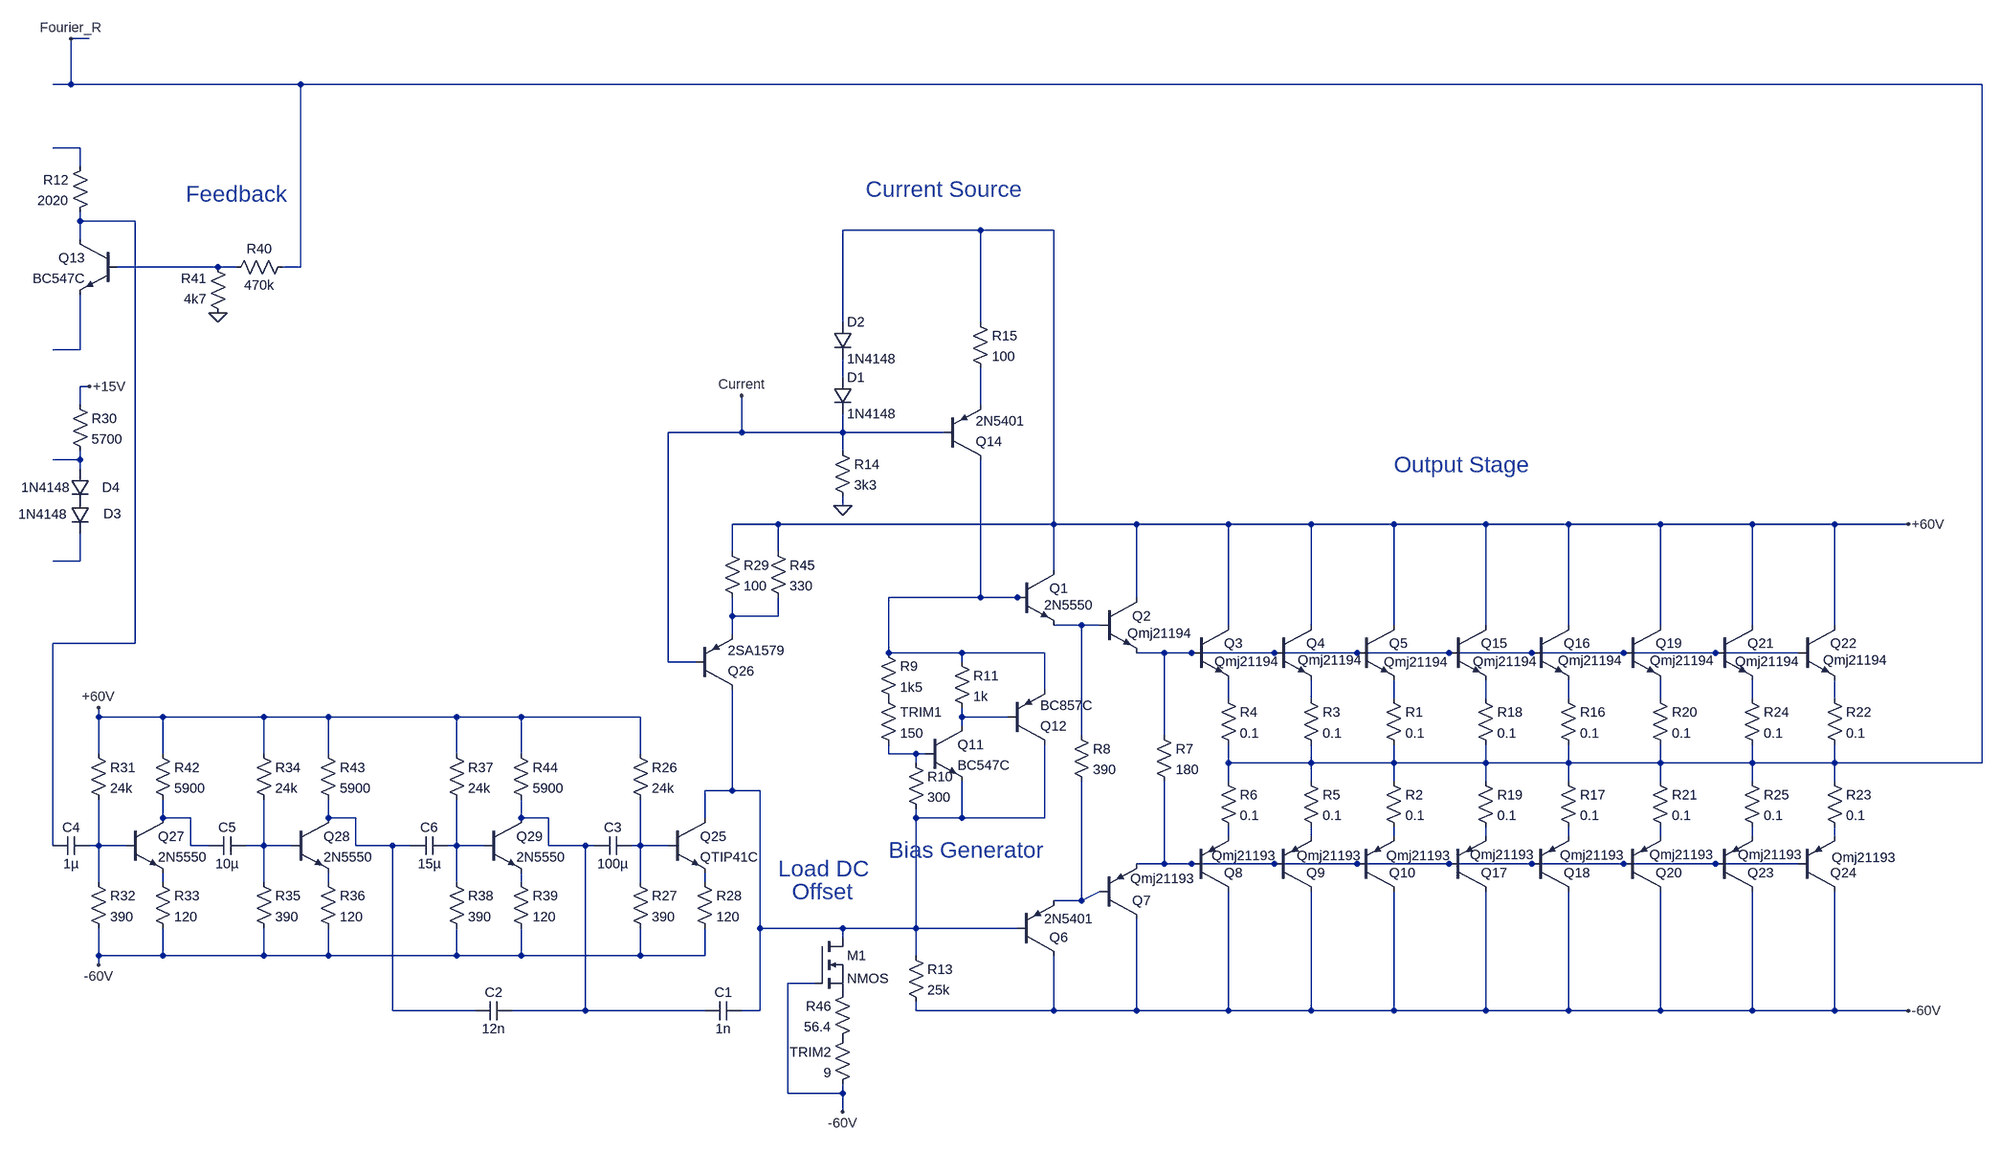
[diagram p0: schematic paltkz2.asc]
paltkz2.asc, the LTspice schematic file:
Version 4
SHEET 1 16980 7664
WIRE 9680 4096 9648 4096
WIRE 9648 4176 9648 4096
WIRE 9648 4176 9616 4176
WIRE 10048 4176 9648 4176
WIRE 12976 4176 10048 4176
WIRE 9664 4368 9616 4368
WIRE 9664 4400 9664 4368
WIRE 9664 4496 9664 4480
WIRE 9760 4496 9664 4496
WIRE 11232 4512 10992 4512
WIRE 11360 4512 11232 4512
WIRE 9664 4528 9664 4496
WIRE 9904 4576 9728 4576
WIRE 9936 4576 9904 4576
WIRE 10048 4576 10048 4176
WIRE 10048 4576 10016 4576
WIRE 10992 4672 10992 4512
WIRE 11232 4672 11232 4512
WIRE 9664 4720 9664 4624
WIRE 9664 4720 9616 4720
WIRE 10992 4768 10992 4736
WIRE 9680 4784 9664 4784
WIRE 9664 4816 9664 4784
WIRE 11232 4816 11232 4752
WIRE 10816 4864 10816 4800
WIRE 10816 4864 10688 4864
WIRE 10992 4864 10992 4832
WIRE 10992 4864 10816 4864
WIRE 11168 4864 10992 4864
WIRE 10992 4896 10992 4864
WIRE 9664 4912 9664 4896
WIRE 9664 4912 9616 4912
WIRE 9664 4928 9664 4912
WIRE 9664 4992 9664 4976
WIRE 10992 4992 10992 4976
WIRE 10880 5024 10800 5024
WIRE 11360 5024 11360 4512
WIRE 11360 5024 10880 5024
WIRE 11504 5024 11360 5024
WIRE 11664 5024 11504 5024
WIRE 11808 5024 11664 5024
WIRE 11952 5024 11808 5024
WIRE 12112 5024 11952 5024
WIRE 12256 5024 12112 5024
WIRE 12416 5024 12256 5024
WIRE 12576 5024 12416 5024
WIRE 12720 5024 12576 5024
WIRE 12848 5024 12720 5024
WIRE 10800 5072 10800 5024
WIRE 10880 5072 10880 5024
WIRE 9664 5088 9664 5040
WIRE 9664 5088 9616 5088
WIRE 11360 5104 11360 5024
WIRE 11232 5152 11232 4912
WIRE 11232 5152 11072 5152
WIRE 11296 5152 11232 5152
WIRE 11312 5152 11296 5152
WIRE 11504 5152 11504 5024
WIRE 10800 5184 10800 5152
WIRE 10880 5184 10880 5152
WIRE 10880 5184 10800 5184
WIRE 11408 5200 11360 5200
WIRE 11440 5200 11408 5200
WIRE 11664 5200 11664 5024
WIRE 11808 5200 11808 5024
WIRE 11952 5200 11952 5024
WIRE 12112 5200 12112 5024
WIRE 12256 5200 12256 5024
WIRE 12416 5200 12416 5024
WIRE 12576 5200 12576 5024
WIRE 12720 5200 12720 5024
WIRE 10800 5216 10800 5184
WIRE 9760 5232 9760 4496
WIRE 9760 5232 9616 5232
WIRE 11072 5248 11072 5152
WIRE 11200 5248 11072 5248
WIRE 11344 5248 11200 5248
WIRE 11552 5248 11504 5248
WIRE 11600 5248 11552 5248
WIRE 11744 5248 11600 5248
WIRE 11888 5248 11744 5248
WIRE 12048 5248 11888 5248
WIRE 12192 5248 12048 5248
WIRE 12352 5248 12192 5248
WIRE 12512 5248 12352 5248
WIRE 12656 5248 12512 5248
WIRE 10688 5264 10688 4864
WIRE 10736 5264 10688 5264
WIRE 11200 5264 11200 5248
WIRE 11344 5312 11344 5248
WIRE 11664 5328 11664 5296
WIRE 11808 5328 11808 5296
WIRE 11952 5328 11952 5296
WIRE 12112 5328 12112 5296
WIRE 12256 5328 12256 5296
WIRE 12416 5328 12416 5296
WIRE 12576 5328 12576 5296
WIRE 12720 5328 12720 5296
WIRE 9696 5360 9696 5344
WIRE 9808 5360 9696 5360
WIRE 9984 5360 9808 5360
WIRE 10096 5360 9984 5360
WIRE 10320 5360 10096 5360
WIRE 10432 5360 10320 5360
WIRE 10640 5360 10432 5360
WIRE 11200 5360 11200 5344
WIRE 11280 5360 11200 5360
WIRE 11200 5376 11200 5360
WIRE 11408 5392 11408 5200
WIRE 11552 5392 11552 5248
WIRE 9696 5424 9696 5360
WIRE 9808 5424 9808 5360
WIRE 9984 5424 9984 5360
WIRE 10096 5424 10096 5360
WIRE 10320 5424 10320 5360
WIRE 10432 5424 10432 5360
WIRE 10640 5424 10640 5360
WIRE 11072 5424 11072 5408
WIRE 11120 5424 11072 5424
WIRE 11136 5424 11120 5424
WIRE 11120 5440 11120 5424
WIRE 11664 5440 11664 5408
WIRE 11808 5440 11808 5408
WIRE 11808 5440 11664 5440
WIRE 11952 5440 11952 5408
WIRE 11952 5440 11808 5440
WIRE 12112 5440 12112 5408
WIRE 12112 5440 11952 5440
WIRE 12256 5440 12256 5408
WIRE 12256 5440 12112 5440
WIRE 12416 5440 12416 5408
WIRE 12416 5440 12256 5440
WIRE 12576 5440 12576 5408
WIRE 12576 5440 12416 5440
WIRE 12720 5440 12720 5408
WIRE 12720 5440 12576 5440
WIRE 12976 5440 12976 4176
WIRE 12976 5440 12720 5440
WIRE 11664 5472 11664 5440
WIRE 11808 5472 11808 5440
WIRE 11952 5472 11952 5440
WIRE 12112 5472 12112 5440
WIRE 12256 5472 12256 5440
WIRE 12416 5472 12416 5440
WIRE 12576 5472 12576 5440
WIRE 12720 5472 12720 5440
WIRE 10800 5488 10800 5312
WIRE 10800 5488 10752 5488
WIRE 10848 5488 10800 5488
WIRE 9808 5536 9808 5504
WIRE 9856 5536 9808 5536
WIRE 10096 5536 10096 5504
WIRE 10144 5536 10096 5536
WIRE 10432 5536 10432 5504
WIRE 10480 5536 10432 5536
WIRE 10752 5536 10752 5488
WIRE 11120 5536 11120 5520
WIRE 11200 5536 11200 5472
WIRE 11200 5536 11120 5536
WIRE 11344 5536 11344 5408
WIRE 11344 5536 11200 5536
WIRE 11664 5568 11664 5552
WIRE 11808 5568 11808 5552
WIRE 11952 5568 11952 5552
WIRE 12112 5568 12112 5552
WIRE 12256 5568 12256 5552
WIRE 12416 5568 12416 5552
WIRE 12576 5568 12576 5552
WIRE 12720 5568 12720 5552
WIRE 9616 5584 9616 5232
WIRE 9696 5584 9696 5504
WIRE 9696 5584 9680 5584
WIRE 9744 5584 9696 5584
WIRE 9856 5584 9856 5536
WIRE 9888 5584 9856 5584
WIRE 9984 5584 9984 5504
WIRE 9984 5584 9952 5584
WIRE 10032 5584 9984 5584
WIRE 10144 5584 10144 5536
WIRE 10208 5584 10144 5584
WIRE 10240 5584 10208 5584
WIRE 10320 5584 10320 5504
WIRE 10320 5584 10304 5584
WIRE 10368 5584 10320 5584
WIRE 10480 5584 10480 5536
WIRE 10544 5584 10480 5584
WIRE 10560 5584 10544 5584
WIRE 10640 5584 10640 5504
WIRE 10640 5584 10624 5584
WIRE 10688 5584 10640 5584
WIRE 11552 5616 11552 5472
WIRE 11552 5616 11504 5616
WIRE 11600 5616 11552 5616
WIRE 11744 5616 11600 5616
WIRE 11888 5616 11744 5616
WIRE 12048 5616 11888 5616
WIRE 12192 5616 12048 5616
WIRE 12352 5616 12192 5616
WIRE 12512 5616 12352 5616
WIRE 12656 5616 12512 5616
WIRE 9696 5648 9696 5584
WIRE 9808 5648 9808 5632
WIRE 9984 5648 9984 5584
WIRE 10096 5648 10096 5632
WIRE 10320 5648 10320 5584
WIRE 10432 5648 10432 5632
WIRE 10640 5648 10640 5584
WIRE 10752 5648 10752 5632
WIRE 11408 5680 11408 5472
WIRE 11408 5680 11440 5664
WIRE 11408 5680 11360 5680
WIRE 10848 5728 10848 5488
WIRE 10992 5728 10848 5728
WIRE 11120 5728 11120 5536
WIRE 11120 5728 10992 5728
WIRE 11296 5728 11120 5728
WIRE 10992 5744 10992 5728
WIRE 9696 5776 9696 5728
WIRE 9808 5776 9808 5728
WIRE 9808 5776 9696 5776
WIRE 9984 5776 9984 5728
WIRE 9984 5776 9808 5776
WIRE 10096 5776 10096 5728
WIRE 10096 5776 9984 5776
WIRE 10320 5776 10320 5728
WIRE 10320 5776 10096 5776
WIRE 10432 5776 10432 5728
WIRE 10432 5776 10320 5776
WIRE 10640 5776 10640 5728
WIRE 10640 5776 10432 5776
WIRE 10752 5776 10752 5728
WIRE 10752 5776 10640 5776
WIRE 11120 5776 11120 5728
WIRE 9696 5792 9696 5776
WIRE 10944 5824 10896 5824
WIRE 10208 5872 10208 5584
WIRE 10352 5872 10208 5872
WIRE 10544 5872 10544 5584
WIRE 10544 5872 10416 5872
WIRE 10752 5872 10544 5872
WIRE 10848 5872 10848 5728
WIRE 10848 5872 10816 5872
WIRE 11120 5872 11120 5856
WIRE 11360 5872 11360 5776
WIRE 11360 5872 11120 5872
WIRE 11504 5872 11504 5712
WIRE 11504 5872 11360 5872
WIRE 11664 5872 11664 5664
WIRE 11664 5872 11504 5872
WIRE 11808 5872 11808 5664
WIRE 11808 5872 11664 5872
WIRE 11952 5872 11952 5664
WIRE 11952 5872 11808 5872
WIRE 12112 5872 12112 5664
WIRE 12112 5872 11952 5872
WIRE 12256 5872 12256 5664
WIRE 12256 5872 12112 5872
WIRE 12416 5872 12416 5664
WIRE 12416 5872 12256 5872
WIRE 12576 5872 12576 5664
WIRE 12576 5872 12416 5872
WIRE 12720 5872 12720 5664
WIRE 12720 5872 12576 5872
WIRE 12848 5872 12720 5872
WIRE 10896 6016 10896 5824
WIRE 10992 6016 10992 6000
WIRE 10992 6016 10896 6016
WIRE 10992 6048 10992 6016
FLAG 10992 4992 0
FLAG 12848 5872 -60V
FLAG 12848 5024 +60V
FLAG 9648 4096 Fourier_R
FLAG 9680 4784 +15V
FLAG 9696 5344 +60V
FLAG 9696 5792 -60V
FLAG 9904 4656 0
FLAG 10816 4800 Current
FLAG 10992 6048 -60V
SYMBOL npn 11296 5104 R0
WINDOW 3 47 61 Left 2
SYMATTR Value 2N5550
SYMATTR InstName Q1
SYMBOL npn 11440 5152 R0
WINDOW 3 48 62 Left 2
SYMATTR Value Qmj21194
SYMATTR InstName Q2
SYMBOL npn 11600 5200 R0
WINDOW 3 40 63 Left 2
SYMATTR Value Qmj21194
SYMATTR InstName Q3
SYMBOL npn 11744 5200 R0
WINDOW 3 41 61 Left 2
SYMATTR Value Qmj21194
SYMATTR InstName Q4
SYMBOL npn 11888 5200 R0
WINDOW 3 47 64 Left 2
SYMATTR Value Qmj21194
SYMATTR InstName Q5
SYMBOL pnp 11296 5776 M180
WINDOW 3 47 64 Left 2
SYMATTR Value 2N5401
SYMATTR InstName Q6
SYMBOL pnp 11440 5712 M180
WINDOW 3 53 70 Left 2
SYMATTR Value Qmj21193
SYMATTR InstName Q7
SYMBOL pnp 11600 5664 M180
WINDOW 3 35 62 Left 2
SYMATTR Value Qmj21193
SYMATTR InstName Q8
SYMBOL pnp 11744 5664 M180
WINDOW 3 39 62 Left 2
SYMATTR Value Qmj21193
SYMATTR InstName Q9
SYMBOL pnp 11888 5664 M180
WINDOW 3 51 62 Left 2
SYMATTR Value Qmj21193
SYMATTR InstName Q10
SYMBOL res 11936 5312 R0
SYMATTR InstName R1
SYMATTR Value 0.1
SYMBOL res 11936 5456 R0
SYMATTR InstName R2
SYMATTR Value 0.1
SYMBOL res 11792 5312 R0
SYMATTR InstName R3
SYMATTR Value 0.1
SYMBOL res 11648 5312 R0
SYMATTR InstName R4
SYMATTR Value 0.1
SYMBOL res 11792 5456 R0
SYMATTR InstName R5
SYMATTR Value 0.1
SYMBOL res 11648 5456 R0
SYMATTR InstName R6
SYMATTR Value 0.1
SYMBOL res 11536 5376 R0
SYMATTR InstName R7
SYMATTR Value 180
SYMBOL res 11392 5376 R0
SYMATTR InstName R8
SYMATTR Value 390
SYMBOL npn 11136 5376 R0
SYMATTR InstName Q11
SYMATTR Value BC547C
SYMBOL res 11056 5232 R0
SYMATTR InstName R9
SYMATTR Value 1k5
SYMBOL res 11104 5424 R0
SYMATTR InstName R10
SYMATTR Value 300
SYMBOL res 11184 5248 R0
SYMATTR InstName R11
SYMATTR Value 1k
SYMBOL pnp 11280 5408 M180
SYMATTR InstName Q12
SYMATTR Value BC857C
SYMBOL npn 9728 4528 M0
SYMATTR InstName Q13
SYMATTR Value BC547C
SYMBOL res 9680 4384 M0
SYMATTR InstName R12
SYMATTR Value 2020
SYMBOL res 11104 5760 R0
SYMATTR InstName R13
SYMATTR Value 25k
SYMBOL pnp 11168 4912 M180
SYMATTR InstName Q14
SYMATTR Value 2N5401
SYMBOL res 10976 4880 R0
SYMATTR InstName R14
SYMATTR Value 3k3
SYMBOL diode 10976 4768 R0
SYMATTR InstName D1
SYMATTR Value 1N4148
SYMBOL diode 10976 4672 R0
SYMATTR InstName D2
SYMATTR Value 1N4148
SYMBOL res 11216 4656 R0
SYMATTR InstName R15
SYMATTR Value 100
SYMBOL npn 12048 5200 R0
WINDOW 3 42 63 Left 2
SYMATTR Value Qmj21194
SYMATTR InstName Q15
SYMBOL npn 12192 5200 R0
WINDOW 3 46 62 Left 2
SYMATTR Value Qmj21194
SYMATTR InstName Q16
SYMBOL pnp 12048 5664 M180
WINDOW 3 37 64 Left 2
SYMATTR Value Qmj21193
SYMATTR InstName Q17
SYMBOL pnp 12192 5664 M180
WINDOW 3 49 63 Left 2
SYMATTR Value Qmj21193
SYMATTR InstName Q18
SYMBOL res 12240 5312 R0
SYMATTR InstName R16
SYMATTR Value 0.1
SYMBOL res 12240 5456 R0
SYMATTR InstName R17
SYMATTR Value 0.1
SYMBOL res 12096 5312 R0
SYMATTR InstName R18
SYMATTR Value 0.1
SYMBOL res 12096 5456 R0
SYMATTR InstName R19
SYMATTR Value 0.1
SYMBOL npn 12352 5200 R0
WINDOW 3 46 62 Left 2
SYMATTR Value Qmj21194
SYMATTR InstName Q19
SYMBOL pnp 12352 5664 M180
WINDOW 3 45 64 Left 2
SYMATTR Value Qmj21193
SYMATTR InstName Q20
SYMBOL res 12400 5312 R0
SYMATTR InstName R20
SYMATTR Value 0.1
SYMBOL res 12400 5456 R0
SYMATTR InstName R21
SYMATTR Value 0.1
SYMBOL npn 12512 5200 R0
WINDOW 3 34 63 Left 2
SYMATTR Value Qmj21194
SYMATTR InstName Q21
SYMBOL npn 12656 5200 R0
WINDOW 3 44 61 Left 2
SYMATTR Value Qmj21194
SYMATTR InstName Q22
SYMBOL pnp 12512 5664 M180
WINDOW 3 39 64 Left 2
SYMATTR Value Qmj21193
SYMATTR InstName Q23
SYMBOL pnp 12656 5664 M180
WINDOW 3 59 59 Left 2
SYMATTR Value Qmj21193
SYMATTR InstName Q24
SYMBOL res 12704 5312 R0
SYMATTR InstName R22
SYMATTR Value 0.1
SYMBOL res 12704 5456 R0
SYMATTR InstName R23
SYMATTR Value 0.1
SYMBOL res 12560 5312 R0
SYMATTR InstName R24
SYMATTR Value 0.1
SYMBOL res 12560 5456 R0
SYMATTR InstName R25
SYMATTR Value 0.1
SYMBOL res 10624 5408 R0
SYMATTR InstName R26
SYMATTR Value 24k
SYMBOL res 10624 5632 R0
SYMATTR InstName R27
SYMATTR Value 390
SYMBOL npn 10688 5536 R0
SYMATTR InstName Q25
SYMATTR Value QTIP41C
SYMBOL res 10736 5632 R0
SYMATTR InstName R28
SYMATTR Value 120
SYMBOL pnp 10736 5312 M180
SYMATTR InstName Q26
SYMATTR Value 2SA1579
SYMBOL res 10784 5056 R0
SYMATTR InstName R29
SYMATTR Value 100
SYMBOL cap 10816 5856 R90
WINDOW 0 0 32 VBottom 2
WINDOW 3 32 32 VTop 2
SYMATTR InstName C1
SYMATTR Value 1n
SYMATTR SpiceLine Rser=0.1
SYMBOL diode 9680 4976 M0
WINDOW 0 -55 30 Left 2
WINDOW 3 39 31 Left 2
SYMATTR InstName D3
SYMATTR Value 1N4148
SYMBOL diode 9680 4928 M0
WINDOW 0 -53 32 Left 2
WINDOW 3 34 32 Left 2
SYMATTR InstName D4
SYMATTR Value 1N4148
SYMBOL res 9648 4800 R0
SYMATTR InstName R30
SYMATTR Value 5700
SYMBOL res 9680 5408 R0
SYMATTR InstName R31
SYMATTR Value 24k
SYMBOL res 9680 5632 R0
SYMATTR InstName R32
SYMATTR Value 390
SYMBOL npn 9744 5536 R0
SYMATTR InstName Q27
SYMATTR Value 2N5550
SYMBOL res 9792 5632 R0
SYMATTR InstName R33
SYMATTR Value 120
SYMBOL res 9968 5408 R0
SYMATTR InstName R34
SYMATTR Value 24k
SYMBOL res 9968 5632 R0
SYMATTR InstName R35
SYMATTR Value 390
SYMBOL npn 10032 5536 R0
SYMATTR InstName Q28
SYMATTR Value 2N5550
SYMBOL res 10080 5632 R0
SYMATTR InstName R36
SYMATTR Value 120
SYMBOL res 10304 5408 R0
SYMATTR InstName R37
SYMATTR Value 24k
SYMBOL res 10304 5632 R0
SYMATTR InstName R38
SYMATTR Value 390
SYMBOL npn 10368 5536 R0
SYMATTR InstName Q29
SYMATTR Value 2N5550
SYMBOL res 10416 5632 R0
SYMATTR InstName R39
SYMATTR Value 120
SYMBOL res 10032 4560 R90
WINDOW 0 0 56 VBottom 2
WINDOW 3 32 56 VTop 2
SYMATTR InstName R40
SYMATTR Value 470k
SYMBOL res 9920 4672 R180
WINDOW 0 36 76 Left 2
WINDOW 3 36 40 Left 2
SYMATTR InstName R41
SYMATTR Value 4k7
SYMBOL res 9792 5408 R0
SYMATTR InstName R42
SYMATTR Value 5900
SYMBOL res 10080 5408 R0
SYMATTR InstName R43
SYMATTR Value 5900
SYMBOL res 10416 5408 R0
SYMATTR InstName R44
SYMATTR Value 5900
SYMBOL cap 10352 5856 M90
WINDOW 0 0 32 VBottom 2
WINDOW 3 32 32 VTop 2
SYMATTR InstName C2
SYMATTR Value 12n
SYMATTR SpiceLine Rser=0.1
SYMBOL cap 10560 5568 M90
WINDOW 0 0 32 VBottom 2
WINDOW 3 32 32 VTop 2
SYMATTR InstName C3
SYMATTR Value 100µ
SYMATTR SpiceLine Rser=0.1
SYMBOL cap 9680 5568 R90
WINDOW 0 0 32 VBottom 2
WINDOW 3 32 32 VTop 2
SYMATTR InstName C4
SYMATTR Value 1µ
SYMBOL cap 9952 5568 R90
WINDOW 0 0 32 VBottom 2
WINDOW 3 32 32 VTop 2
SYMATTR InstName C5
SYMATTR Value 10µ
SYMBOL cap 10304 5568 R90
WINDOW 0 0 32 VBottom 2
WINDOW 3 32 32 VTop 2
SYMATTR InstName C6
SYMATTR Value 15µ
SYMBOL res 10864 5056 R0
SYMATTR InstName R45
SYMATTR Value 330
SYMBOL res 11056 5312 R0
SYMATTR InstName TRIM1
SYMATTR Value 150
SYMBOL res 11008 5824 M0
SYMATTR InstName R46
SYMATTR Value 56.4
SYMBOL res 11008 5904 M0
SYMATTR InstName TRIM2
SYMATTR Value 9
SYMBOL nmos 10944 5744 R0
SYMATTR InstName M1
TEXT 9848 4448 Left 4 ;Feedback
TEXT 11952 4920 Left 4 ;Output Stage
TEXT 10880 5624 Left 4 ;Load DC
TEXT 11032 4440 Left 4 ;Current Source
TEXT 11072 5592 Left 4 ;Bias Generator
TEXT 10904 5664 Left 4 ;Offset

The netlist it stands for:
* paltkz2.asc
Q1 +60V N010 N012 0 2N5550
Q2 +60V N012 N013 0 Qmj21194
Q3 +60V N013 N014 0 Qmj21194
Q4 +60V N013 N015 0 Qmj21194
Q5 +60V N013 N016 0 Qmj21194
Q6 -60V N024 N045 0 2N5401
Q7 -60V N045 N040 0 Qmj21193
Q8 -60V N040 N028 0 Qmj21193
Q9 -60V N040 N029 0 Qmj21193
Q10 -60V N040 N030 0 Qmj21193
R1 N016 Fourier_R 0.1
R2 Fourier_R N030 0.1
R3 N015 Fourier_R 0.1
R4 N014 Fourier_R 0.1
R5 Fourier_R N029 0.1
R6 Fourier_R N028 0.1
R7 N013 N040 180
R8 N012 N045 390
Q11 N022 N023 N024 0 BC547C
R9 N010 P001 1k5
R10 N023 N024 300
R11 N010 N022 1k
Q12 N024 N022 N010 0 BC857C
Q13 N002 N003 N004 0 BC547C
R12 N001 N002 2020
R13 N024 -60V 25k
Q14 N010 Current N006 0 2N5401
R14 Current 0 3k3
D1 N005 Current 1N4148
D2 +60V N005 1N4148
R15 +60V N006 100
Q15 +60V N013 N017 0 Qmj21194
Q16 +60V N013 N018 0 Qmj21194
Q17 -60V N040 N031 0 Qmj21193
Q18 -60V N040 N032 0 Qmj21193
R16 N018 Fourier_R 0.1
R17 Fourier_R N032 0.1
R18 N017 Fourier_R 0.1
R19 Fourier_R N031 0.1
Q19 +60V N013 N019 0 Qmj21194
Q20 -60V N040 N033 0 Qmj21193
R20 N019 Fourier_R 0.1
R21 Fourier_R N033 0.1
Q21 +60V N013 N020 0 Qmj21194
Q22 +60V N013 N021 0 Qmj21194
Q23 -60V N040 N034 0 Qmj21193
Q24 -60V N040 N035 0 Qmj21193
R22 N021 Fourier_R 0.1
R23 Fourier_R N035 0.1
R24 N020 Fourier_R 0.1
R25 Fourier_R N034 0.1
R26 +60V N039 24k
R27 N039 -60V 390
Q25 N024 N039 N044 0 QTIP41C
R28 N044 -60V 120
Q26 N024 Current N011 0 2SA1579
R29 +60V N011 100
C1 N024 N027 1n Rser=0.1
D3 N008 N009 1N4148
D4 N007 N008 1N4148
R30 +15V N007 5700
R31 +60V N036 24k
R32 N036 -60V 390
Q27 N025 N036 N041 0 2N5550
R33 N041 -60V 120
R34 +60V N037 24k
R35 N037 -60V 390
Q28 N026 N037 N042 0 2N5550
R36 N042 -60V 120
R37 +60V N038 24k
R38 N038 -60V 390
Q29 N027 N038 N043 0 2N5550
R39 N043 -60V 120
R40 Fourier_R N003 470k
R41 0 N003 4k7
R42 +60V N025 5900
R43 +60V N026 5900
R44 +60V N027 5900
C2 N026 N027 12n Rser=0.1
C3 N027 N039 100µ Rser=0.1
C4 N036 N002 1µ
C5 N037 N025 10µ
C6 N038 N026 15µ
R45 +60V N011 330
R§TRIM1 P001 N023 150
R46 P002 P003 56.4
R§TRIM2 P003 -60V 9
M1 N024 -60V P002 P002 NMOS
.model D D
.lib standard.dio
.model NPN NPN
.model PNP PNP
.lib standard.bjt
.model NMOS NMOS
.model PMOS PMOS
.lib standard.mos
* Feedback
* Output Stage
* Load DC
* Current Source
* Bias Generator
* Offset
.backanno
.end